# EAGLE design PayloadV4 (EAGLE 9.0.0)
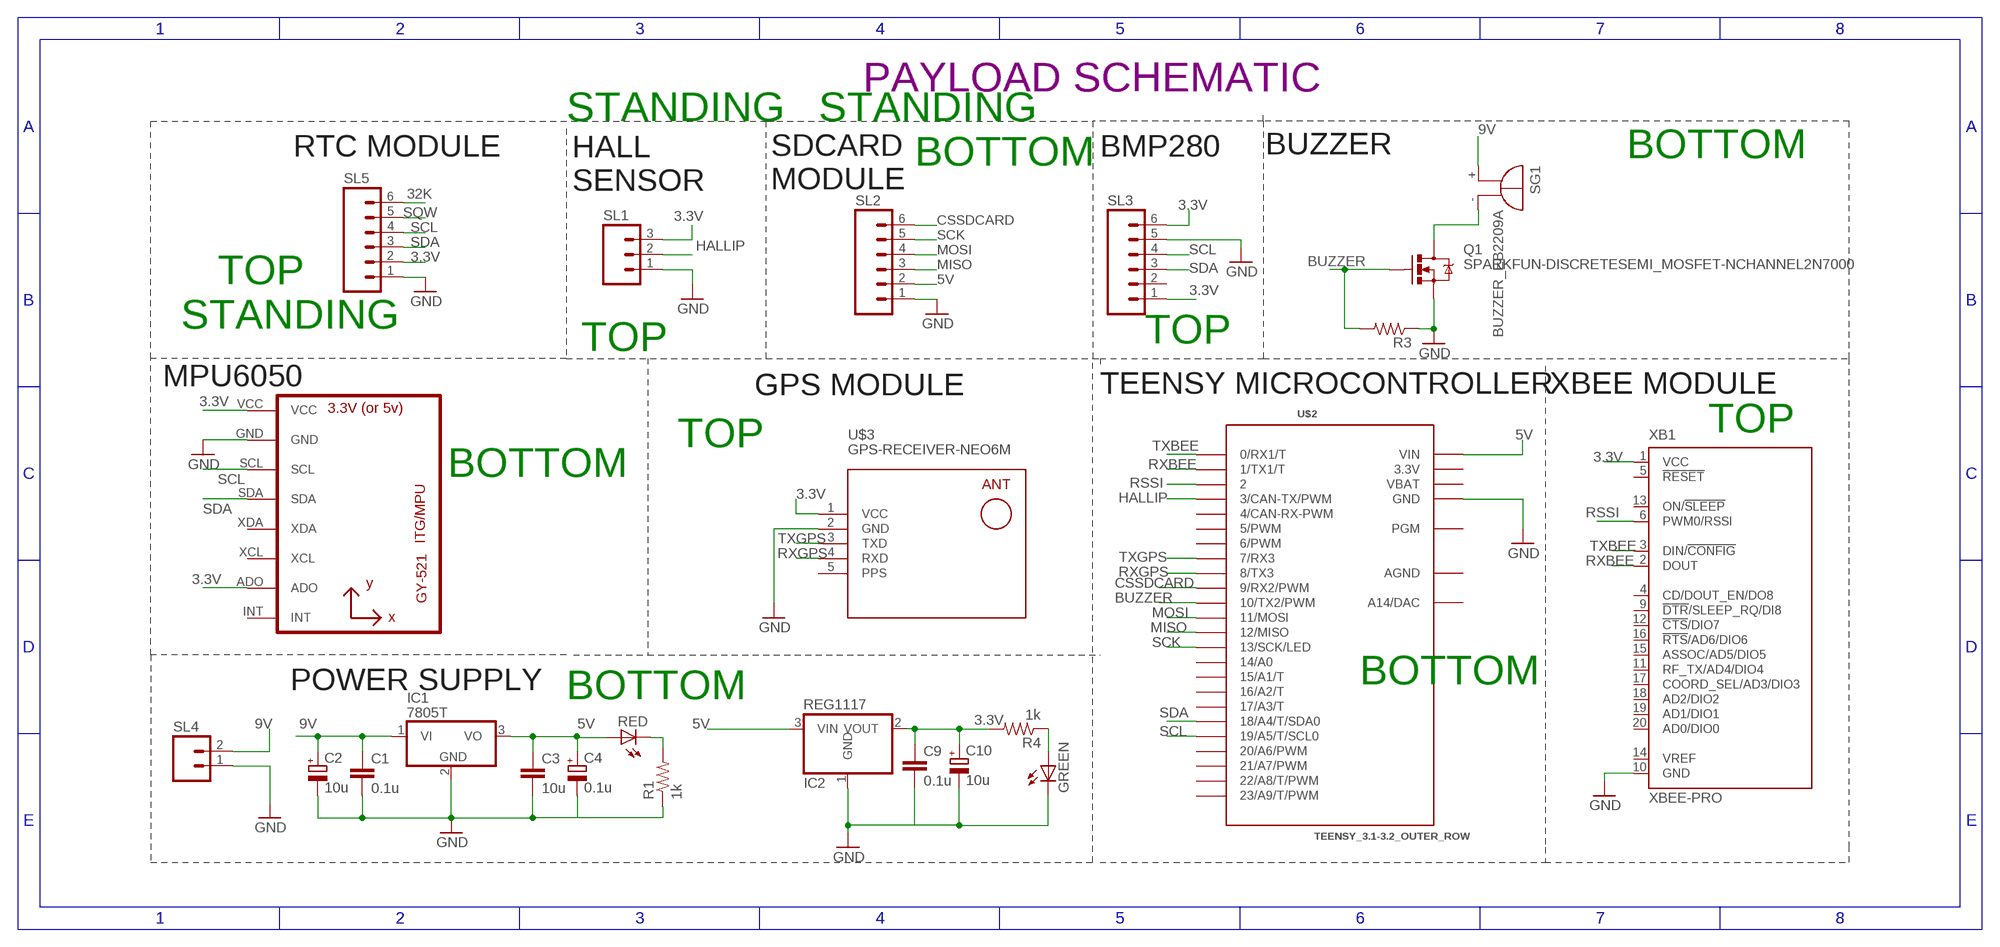
[diagram p0: schematic, sheet 1]

## Parts
C1  0.1u  C-EU025-025X050  [C025-025X050]
C2  10u  CPOL-EUE2.5-6  [E2,5-6]
C3  10u  C-EU025-025X050  [C025-025X050]
C4  0.1u  CPOL-EUE2.5-6  [E2,5-6]
C9  0.1u  C-EU025-025X050  [C025-025X050]
C10  10u  CPOL-EUE2.5-6  [E2,5-6]
GREEN  red  LED3MM  [LED3MM]
IC1  7805T  [TO220H]
IC2  REG1117  [SOT223]
Q1  SPARKFUN-DISCRETESEMI_MOSFET-NCHANNEL2N7000  [SPARKFUN-DISCRETESEMI_TO-92]
R1  1k  R-US_0204/7  [0204/7]
R3  R-US_0204/7  [0204/7]
R4  1k  R-US_0204/7  [0204/7]
RED  red  LED3MM  [LED3MM]
SG1  BUZZER_EB2209A  [BUZZER_EB2209A]
SL1  M03  [03P]
SL2  M06  [06P]
SL3  M06  [06P]
SL4  M02  [02P]
SL5  M06  [06P]
U1  GY-521MPU6050  [GY-521]
U$2  TEENSY_3.1-3.2_OUTER_ROW  [TEENSY_3.0-3.2&LC_OUTER_ROW]
U$3  GPS-RECEIVER-NEO6M  [GPS-RECEIVER-NEO6M]
XB1  XBEE-PRO  [XBEE-PRO]

## Nets
3.3V: C9.1 C10.+ IC2.2(VOUT) R4.2 SL1.3 SL3.1 SL3.6 SL5.2 U1.ADO U1.VCC U$3.1(VCC) XB1.1(VCC)
5V: C3.1 C4.+ IC1.3(VO) IC2.3(VIN) RED.A SL2.2 U$2.VIN
9V: C1.1 C2.+ IC1.1(VI) SG1.+ SL4.2
32K: SL5.6
BUZZER: Q1.2(G) R3.2 U$2.10(10/TX2/PWM)
CSSDCARD: SL2.6 U$2.9(9/RX2/PWM)
GND: C1.2 C2.- C3.2 C4.- C9.2 C10.- GREEN.K(C) IC1.2(GND) IC2.1(GND) Q1.1(S) R1.1 R3.1 SL1.1 SL2.1 SL3.5 SL4.1 SL5.1 U1.GND U$2.GND U$2.GND1(GND) U$3.2(GND) XB1.10(GND)
HALLIP: SL1.2 U$2.3(3/CAN-TX/PWM)
MISO: SL2.3 U$2.12(12/MISO)
MOSI: SL2.4 U$2.11(11/MOSI)
N$1: R1.2 RED.K(C)
N$2: GREEN.A R4.1
N$3: Q1.3(D) SG1.-
RSSI: U$2.2 XB1.6(PWM0/RSSI)
RXBEE: U$2.1(1/TX1/T) XB1.2(DOUT)
RXGPS: U$2.8(8/TX3) U$3.4(RXD)
SCK: SL2.5 U$2.13(13/SCK/LED)
SCL: SL3.4 SL5.4 U1.SCL U$2.19/A5(19/A5/T/SCL0)
SDA: SL3.3 SL5.3 U1.SDA U$2.18/A4(18/A4/T/SDA0)
SQW: SL5.5
TXBEE: U$2.0(0/RX1/T) XB1.3(DIN/!CONFIG)
TXGPS: U$2.7(7/RX3) U$3.3(TXD)
Unconnected: SL3.2 U1.INT U1.XCL U1.XDA U$2.4(4/CAN-RX-PWM) U$2.5(5/PWM) U$2.6(6/PWM) U$2.14/A0 U$2.15/A1(15/A1/T) U$2.16/A2(16/A2/T) U$2.17/A3(17/A3/T) U$2.20/A6(20/A6/PWM) U$2.21/A7(21/A7/PWM) U$2.22/A8(22/A8/T/PWM) U$2.23/A9(23/A9/T/PWM) U$2.PGM U$2.RESET/DAC(A14/DAC) XB1.4(CD/DOUT_EN/DO8) XB1.5(!RESET) XB1.9(!DTR!/SLEEP_RQ/DI8) XB1.11(RF_TX/AD4/DIO4) XB1.12(!CTS!/DIO7) XB1.13(ON/!SLEEP) XB1.14(VREF) XB1.15(ASSOC/AD5/DIO5) XB1.16(!RTS!/AD6/DIO6) XB1.17(COORD_SEL/AD3/DIO3) XB1.18(AD2/DIO2) XB1.19(AD1/DIO1) XB1.20(AD0/DIO0)

## Notes on the sheet
- PAYLOAD SCHEMATIC
- STANDING | STANDING
- RTC MODULE | BMP280 | BUZZER | BOTTOM
- BOTTOM
- SDCARD
  MODULE
- HALL
  SENSOR
- TOP
- STANDING
- TOP | TOP
- MPU6050 | TEENSY MICROCONTROLLER | XBEE MODULE
- GPS MODULE
- TOP
- TOP
- BOTTOM
- POWER SUPPLY | BOTTOM
- BOTTOM

## Power pins joined to a net without a drawn wire
3.3V: U$2.3.3V U$2.3.3V1(3.3V)
AGND: U$2.AGND
PPS: U$3.5(PPS)
VBAT: U$2.VBAT

## Library data of the parts
C1 C3 C9 = resistor:C-EU: CAPACITOR, European symbol
C2 C4 C10 = rcl:CPOL-EU: POLARIZED CAPACITOR, European symbol; SPICEPREFIX: C
GREEN RED = CEDT_JANUARY_2015_v5:LED
IC1 = linear:78*: Positive VOLTAGE REGULATOR Source: http://cache.national.com/ds/LM/LM78L05.pdf http://www.fairchildsemi.com/ds/LM/LM7805.pdf
IC2 = CEDT_JANUARY_2015_v5:REG1117: 800mA and 1A Low Dropout (LDO) Positive Regulator 1.8V, 2.5V, 2.85V, 3.3V, 5V, and Adj
Q1 = Cansat2019_3279_Container_v01:SPARKFUN-DISCRETESEMI_MOSFET-NCHANNEL: Common NMOSFET Parts MFG P/N Store ID Prod ID FDD8780 TRANS-09984 SI7820DN TRANS-11055 FDS6630A IC-08089 2N7002PW TRANS-11151 FQP30N06L COM-10213 TRANS-10060 BSS123LT1G TRANS-08345 BSS138 TRANS-00830 BS170 2N7000
R1 R3 R4 = rcl:R-US_: RESISTOR, American symbol; SPICEPREFIX: R
SG1 = Cansat2019_3279_Container_v01:BUZZER_EB2209A: BUZZER Source: Buerklin; OC_FARNELL: unknown; OC_NEWARK: unknown
SL1 = con-amp-quick:M03: AMP QUICK CONNECTOR; OC_FARNELL: unknown; OC_NEWARK: unknown
SL2 SL3 SL5 = con-amp-quick:M06: AMP QUICK CONNECTOR; OC_FARNELL: unknown; OC_NEWARK: unknown
SL4 = CEDT_JANUARY_2015_v5:M02: AMP QUICK CONNECTOR
U1 = gy-521:GY-521
U$2 = Teensy_3_and_LC_Series_Boards_v1.4:TEENSY_3.1-3.2_OUTER_ROW: Footprint for Teensy 3.1 or 3.2 board using all pin connections on the outer perimeter
U$3 = diy-modules:GPS-RECEIVER-NEO6M: GPS Receiver Module based on NEO-6 device Short tutorial how to use NEO-6 module with Arduino: http://www.xarg.org/2016/06/neo6mv2-gps-module-with-arduino/ NEO-6 datasheet is available here: https://www.u-blox.com/sites/default/files/products/documents/NEO-6_DataSheet_%28GPS.G6-HW-09005%29.pdf Click here to find device on ebay.com <http://www.ebay.com/sch/gyneo6mv2>
XB1 = maxstream:XBEE: XBee (TM) /XBee-PRO(TM) OEM RF Modules Source: MaxStream, Inc. xbee_productmanual.pdf; MPN: XBP24-AWI-001; OC_FARNELL: 1337916; OC_NEWARK: 42M2667

## Board
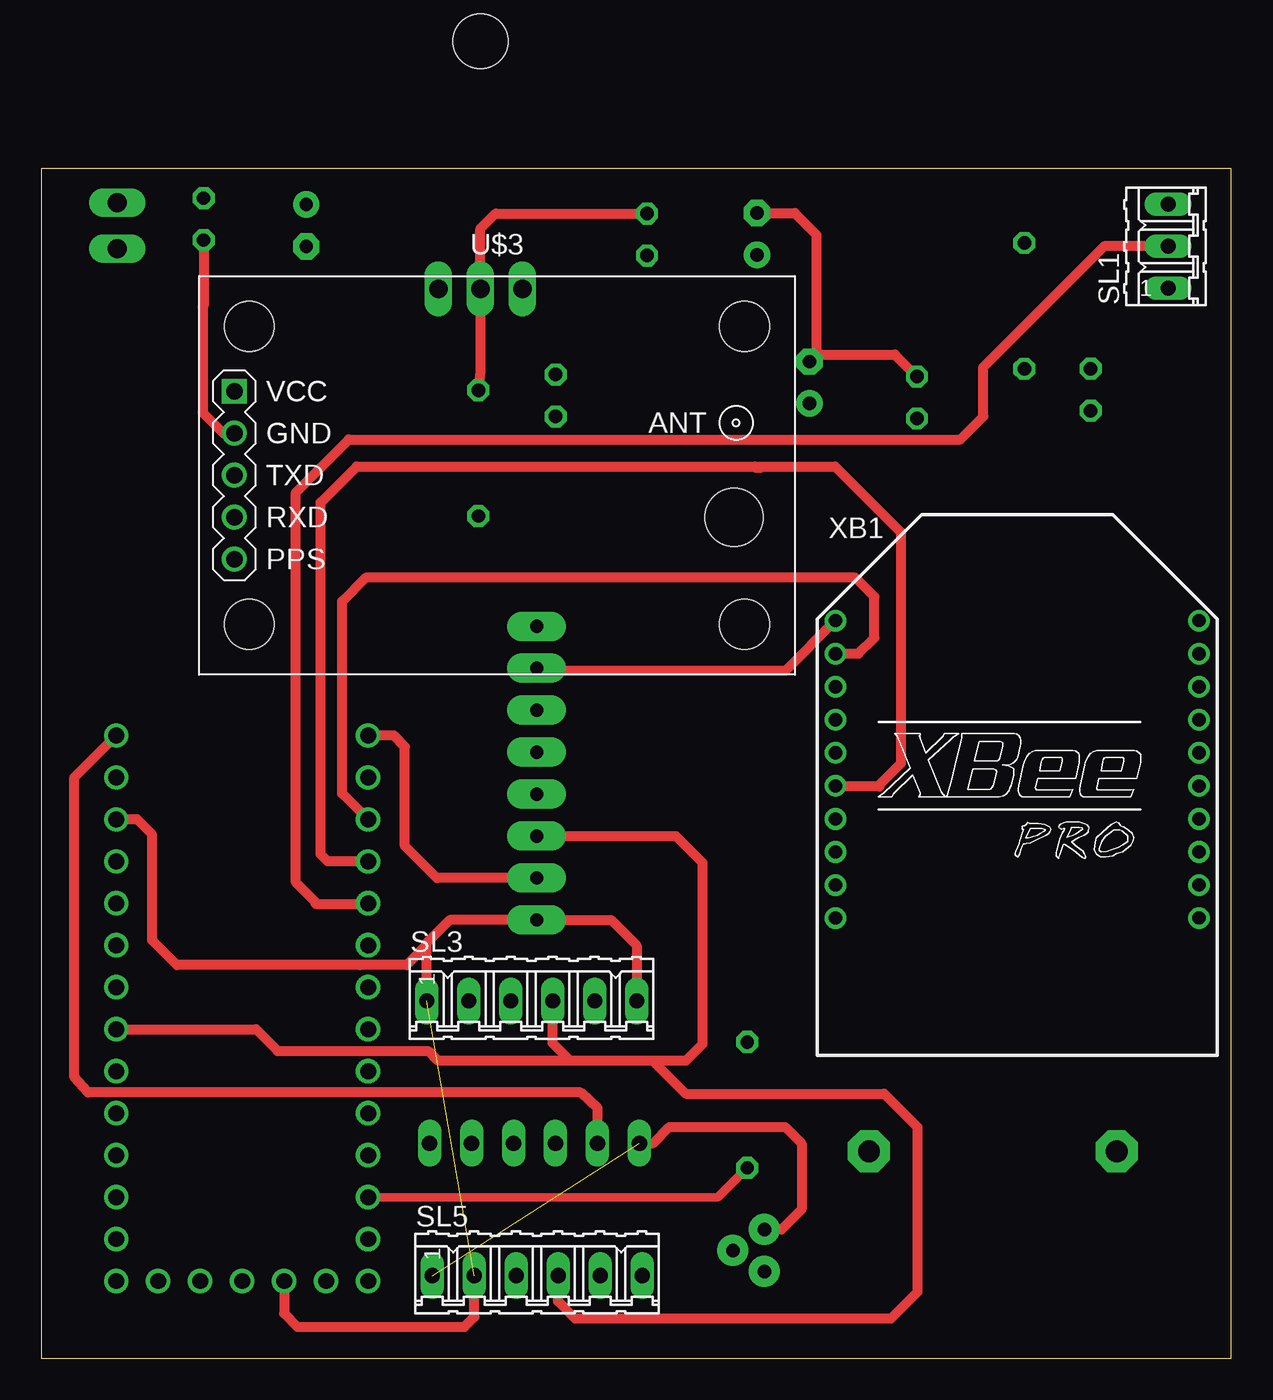
[diagram p1: board, top side]
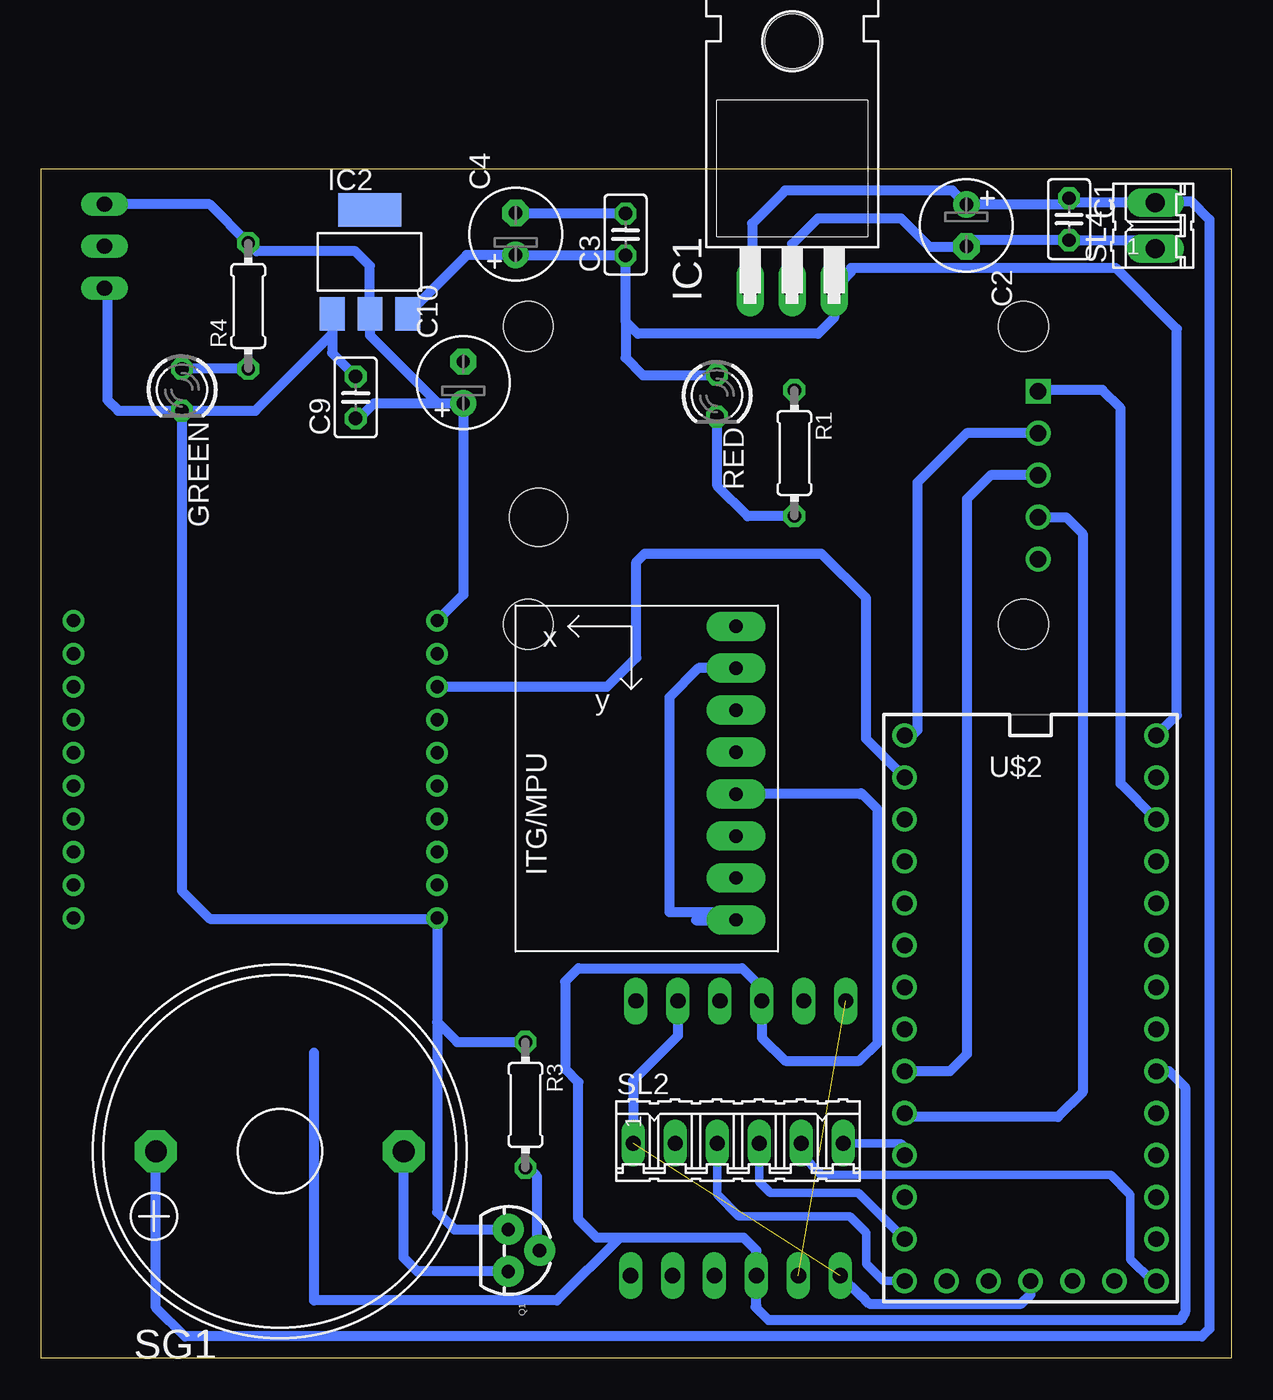
[diagram p2: board, bottom side, seen from below]

Size 72 x 72 mm. Coordinates in mm from the lower left corner, seen from the top.
Outline: 0,0 72,0 72,72 0,72 0,0
Copper layers (1*16): Top 0.035mm / dielectric 1.5mm / Bottom 0.035mm
Design rules "default": minimum track width 6mil, minimum drill 0.35mm, track to track 6mil, track to pad 6mil, pad to pad 6mil, via to via 6mil, smd to smd 6mil, copper to edge 40mil, drill to drill 6mil, minimum pad ring 10mil, minimum via ring 8mil, stop-mask expansion 4mil, vias tented up to drill 0mil, thermal gap 10mil

### Footprints (pad centres in the part's own frame; a part is rotated, then mirrored left to right if it is on the bottom)
C025-025X050 = drill 0.813 octagon: 1 -1.27,0; 2 1.27,0
E2,5-6 = drill 0.813 pad 1.6: + -1.27,0 | drill 0.813 pad 1.6 octagon: - 1.27,0
LED3MM = drill 0.813 octagon: A -1.27,0; K 1.27,0
TO220H = drill 1.118 long: 1 -2.54,-10.16; 2 0,-10.16; 3 2.54,-10.16 | hole 3.302: 0,4.826
SOT223 = smd 1.499 x 2.007: 1 -2.261,-3.15; 2 0.025,-3.15; 3 2.311,-3.15 | smd 3.81 x 2.007: 4 0,3.15
SPARKFUN-DISCRETESEMI_TO-92 = drill 0.813 pad 1.88: 1 -1.27,0; 2 0,1.905; 3 1.27,0
0204/7 = drill 0.813 octagon: 1 -3.81,0; 2 3.81,0
BUZZER_EB2209A = drill 1.321 pad 2.54 octagon: + 7.493,0; - -7.493,0
03P = drill 0.914 long: 1 -2.54,0; 2 0,0; 3 2.54,0
06P = drill 0.914 long: 1 -6.35,0; 2 -3.81,0; 3 -1.27,0; 4 1.27,0; 5 3.81,0; 6 6.35,0
02P = drill 1.143 long: 1 -1.397,0; 2 1.397,0
GY-521 = drill 0.8 pad 1.778 long: ADO -8.89,-6.35; GND -8.89,6.35; INT -8.89,-8.89; SCL -8.89,3.81; SDA -8.89,1.27; VCC -8.89,8.89; XCL -8.89,-3.81; XDA -8.89,-1.27
TEENSY_3.0-3.2&LC_OUTER_ROW = drill 0.965: 0 -7.62,13.97; 1 -7.62,11.43; 2 -7.62,8.89; 3 -7.62,6.35; 3.3V 7.62,11.43; 3.3V1 -2.54,-16.51; 4 -7.62,3.81; 5 -7.62,1.27; 6 -7.62,-1.27; 7 -7.62,-3.81; 8 -7.62,-6.35; 9 -7.62,-8.89; 10 -7.62,-11.43; 11 -7.62,-13.97; 12 -7.62,-16.51; 13 7.62,-16.51; 14/A0 7.62,-13.97; 15/A1 7.62,-11.43; 16/A2 7.62,-8.89; 17/A3 7.62,-6.35; 18/A4 7.62,-3.81; 19/A5 7.62,-1.27; 20/A6 7.62,1.27; 21/A7 7.62,3.81; 22/A8 7.62,6.35; 23/A9 7.62,8.89; AGND 7.62,13.97; GND -7.62,16.51; GND1 0,-16.51; PGM 2.54,-16.51; RESET/DAC 5.08,-16.51; VBAT -5.08,-16.51; VIN 7.62,16.51
GPS-RECEIVER-NEO6M = drill 1 square: 1 -15.875,5.08 | drill 1: 2 -15.875,2.54; 3 -15.875,0; 4 -15.875,-2.54; 5 -15.875,-5.08 | hole 3: -14.986,9.017; -14.986,-9.017; 14.986,-9.017; 14.986,9.017 | hole 3.5: 14.351,-2.54
XBEE-PRO = drill 0.8 pad 1.27: 1 -11,9; 2 -11,7; 3 -11,5; 4 -11,3; 5 -11,1; 6 -11,-1; 7 -11,-3; 8 -11,-5; 9 -11,-7; 10 -11,-9; 11 11,-9; 12 11,-7; 13 11,-5; 14 11,-3; 15 11,-1; 16 11,1; 17 11,3; 18 11,5; 19 11,7; 20 11,9

### Placement (x,y rotation side)
C1  9.82,68.94 270 bottom
C2  16.03,68.56 270 bottom
C3  36.65,68.01 90 bottom
C4  43.3,68.04 90 bottom
C9  52.98,58.15 90 bottom
C10  46.47,59.05 90 bottom
GREEN  63.49,58.62 270 bottom
IC1  26.57,74.88 0 bottom
IC2  52.14,66.36 0 bottom
Q1  43.75,6.52 270 bottom
R1  26.44,54.78 270 bottom
R3  42.71,15.33 270 bottom
R4  59.48,63.69 90 bottom
RED  31.12,58.27 270 bottom
SG1  57.57,12.53 180 bottom
SL1  68.18,67.3 90 top
SL2  29.84,13.01 0 bottom
SL3  29.67,21.62 0 top
SL4  4.59,68.55 90 bottom
SL5  30,5 0 top
U1  38.86,35.41 180 bottom
U$2  12.15,21.18 0 bottom
U$3  27.56,53.44 0 top
XB1  59.05,35.64 0 top

### Tracks (layer width: path | path; a pad name or v marks a point on that pad's centre or on a via)
3.3V  (1 unrouted)
  Top 0.61: 23.3,25 23.3,25.1 24.72,26.52 U1.VCC 34.48,26.52 36.02,24.98 SL3.6 | 23.3,25 23.3,21.64 SL3.1 | U$2.3.3V1 14.69,2.71 15.5,1.9 25.6,1.9 26.2,2.5 SL5.2 | 23.3,25 22.1,23.8 19.28,23.8 19.27,23.8 8.2,23.8 6.7,25.3 6.7,31.7 5.79,32.61 U$2.3.3V | XB1.1 45.01,41.6 30.13,41.6 U1.ADO
  Bottom 0.61: IC2.2 52.12,66.11 53,67 58.98,67 R4.2 61.82,69.84 SL1.3 | IC2.2 51.8,62.89 | IC2.2 52.12,62.3 | IC2.2 52.12,61.91 48,57.8 48,57.78 | 48,57.78 C10.+ 46.47,46.22 XB1.1 | 48,57.78 51.88,57.78 52.78,56.88 C9.1 | 32.4,26.5 30,26.5 | 30,26.5 29.99,26.5 U1.VCC | 11.77,58.6 U$3.1 11.61,58.6 7.8,58.6 6.7,57.5 6.7,34.78 U$2.3.3V | U1.ADO 32.24,41.76 34,40 34,27 30.5,27 30,26.5
5V
  Top 0.61: SL2.2 33.65,15.15 32.62,16.08 2.82,16.08 2,17 2,35.16 U$2.VIN
  Bottom 0.61: IC2.3 46.26,66.77 C4.+ 43.27,66.74 C3.1 36.65,62.75 | IC1.3 24.03,62.97 25,62 35.9,62 36.65,62.75 | IC1.3 23.35,65.4 | 36.65,62.75 36.65,60.55 35.6,59.5 31.16,59.5 RED.A | U$2.VIN 3.3,38.92 3.3,62.3 7,66 23,66 23,65.75 IC1.3
9V
  Bottom 0.61: 29,64.61 29,68.68 27,70.68 16.88,70.68 C2.+ 10.2,69.83 C1.1 9.56,69.95 SL4.2 4.65,70 | 29,64 29,64.61 | 29,64.61 IC1.1 | 4.65,70 2.4,70 1.32,68.92 1.32,1.78 1.78,1.32 63.32,1.32 65.06,3.06 SG1.+ | 5,70 4.65,70
BUZZER
  Top 0.508: U$2.10 40.94,9.75 R3.2
  Bottom 0.61: Q1.2 42,6.67 42,11 42.52,11.52 R3.2
CSSDCARD
  Bottom 0.508: SL2.6 20,13 19.77,12.77 U$2.9
GND  (1 unrouted)
  Top 0.61: C3.2 27.52,69.28 27.5,69.3 26.57,68.37 IC1.2 26.57,59.72 R1.1 | U1.GND 23.94,29.06 22,31 22,37 21.31,37.69 U$2.GND | C4.- 45.59,69.31 46.9,68 46.9,60.75 | 46.9,60.75 C10.- | 46.9,60.75 51.65,60.75 C9.2 | SL2.1 37.01,13.01 38,14 45,14 46,13 46,9 44.79,7.79 Q1.1 | U$3.2 11.02,55.98 9.75,57.25 9.75,63.62 9.82,63.69 C1.2
  Bottom 0.61: IC1.2 26.57,67.43 25,69 20,69 18.29,67.29 C2.- 15.65,67.67 C1.2 5.11,67.67 SL4.1 | C3.2 43.27,69.28 C4.- | SL1.1 68,64.58 68,58 67.35,57.35 GREEN.K | 48.05,20.35 XB1.10 48.09,26.6 61.8,26.6 63.49,28.29 GREEN.K | R3.1 46.84,19.14 48.05,20.35 | U$3.2 16.02,55.98 19,53 19,38 19.31,37.69 U$2.GND | 52.88,59.32 C9.2 54.4,60.84 54.4,62 | IC2.1 54.4,62 | GREEN.K 59.05,57.35 54.4,62 | 48.05,20.35 48.05,8.85 46.99,7.79 Q1.1 | SL3.5 33.48,19.52 36.19,16.81 SL2.1 | SL5.1 22.45,3.8 22.4,3.8 21.9,3.3 12.7,3.3 12.15,3.85 U$2.GND1
HALLIP
  Top 0.61: SL1.2 64.3,67.3 57,60 57,57 55.6,55.6 18.6,55.6 15.4,52.4 15.4,28.8 16.6,27.6 16.6,27.5 19.74,27.5 U$2.3
MISO
  Bottom 0.508: SL2.3 31.11,9.91 29.8,8.6 23.1,8.6 22.1,7.6 22.1,5.7 21.07,4.67 U$2.12
MOSI
  Bottom 0.508: U$2.11 22.56,10 27.9,10 28.57,10.67 SL2.4
N$1
  Bottom 0.61: RED.K 31.1,56.98 31.1,52.8 29.27,50.97 R1.2
N$2
  Bottom 0.61: R4.1 GREEN.A
N$3
  Bottom 0.61: Q1.3 49.25,5.25 50.08,6.08 SG1.-
RSSI
  Top 0.61: U$2.2 17.33,30.07 16.9,30.5 16.9,50.4 16.9,51.8 19.07,53.97 43.18,53.97 | 43.18,53.97 43.25,53.9 43.5,53.9 | 43.18,53.97 48.03,53.97 52,50 52,36 50.7,34.7 50.7,34.6 48.09,34.6 XB1.6
RXBEE
  Top 0.61: U$2.1 18.2,34.18 18.2,45.8 19.64,47.24 49.26,47.24 50.4,46.1 50.4,43.6 49.44,42.64 XB1.2
RXGPS
  Bottom 0.61: U$3.4 10,50.9 9,49.9 9,16.1 10.5,14.6 19.54,14.6 U$2.8
SCK
  Bottom 0.508: SL2.5 26.03,12.33 24.8,11.1 7.3,11.1 6.1,9.9 6.1,6 4.77,4.67 U$2.13
SCL
  Top 0.61: U1.SCL 38.4,31.6 40,30 40,19 39,18 37,18 | 37,18 32,18 | SL3.4 30.94,19.06 32,18 | 37,18 39,16 51,16 53,14 53,4 51.4,2.4 32.3,2.4 31.27,3.43 SL5.4 | U$2.19/A5 12.99,19.91 14.3,18.6 23.4,18.6 24,18 32,18
SDA
  Bottom 0.61: 37,7.3 29.5,7.3 28.73,6.53 SL5.3 28.73,3.17 28.8,3.1 28,2.3 3.1,2.3 2.8,2.8 2.8,16.4 3.77,17.37 U$2.18/A4 | 37,7.3 38.4,7.3 39.5,8.4 39.5,16.7 40.3,17.5 40.3,22.8 39.5,23.6 29.6,23.6 28,22 28.38,21.62 SL3.3 28.4,19.4 27,18 22.5,18 21.4,19.1 21.4,33.2 22.4,34.2 22.46,34.14 U1.SDA | 37,7.3 40.8,3.5 55.5,3.5 55.5,18.5
TXBEE
  Bottom 0.61: U$2.0 22.1,37.48 22.1,46 24.8,48.7 35.5,48.7 36,48.2 36,42.4 37.76,40.64 XB1.3
TXGPS
  Bottom 0.61: U$3.3 14.56,53.44 16,52 16,18.4 17.03,17.37 U$2.7